# Altium schematic sheet Sheet1.SchDoc
size A3; SheetNumber: 1; SheetTotal: 1; ENG_APP_DATE: --/--/--; DSN_APP_DATE: --/--/--; CHK_APP_DATE: --/--/--
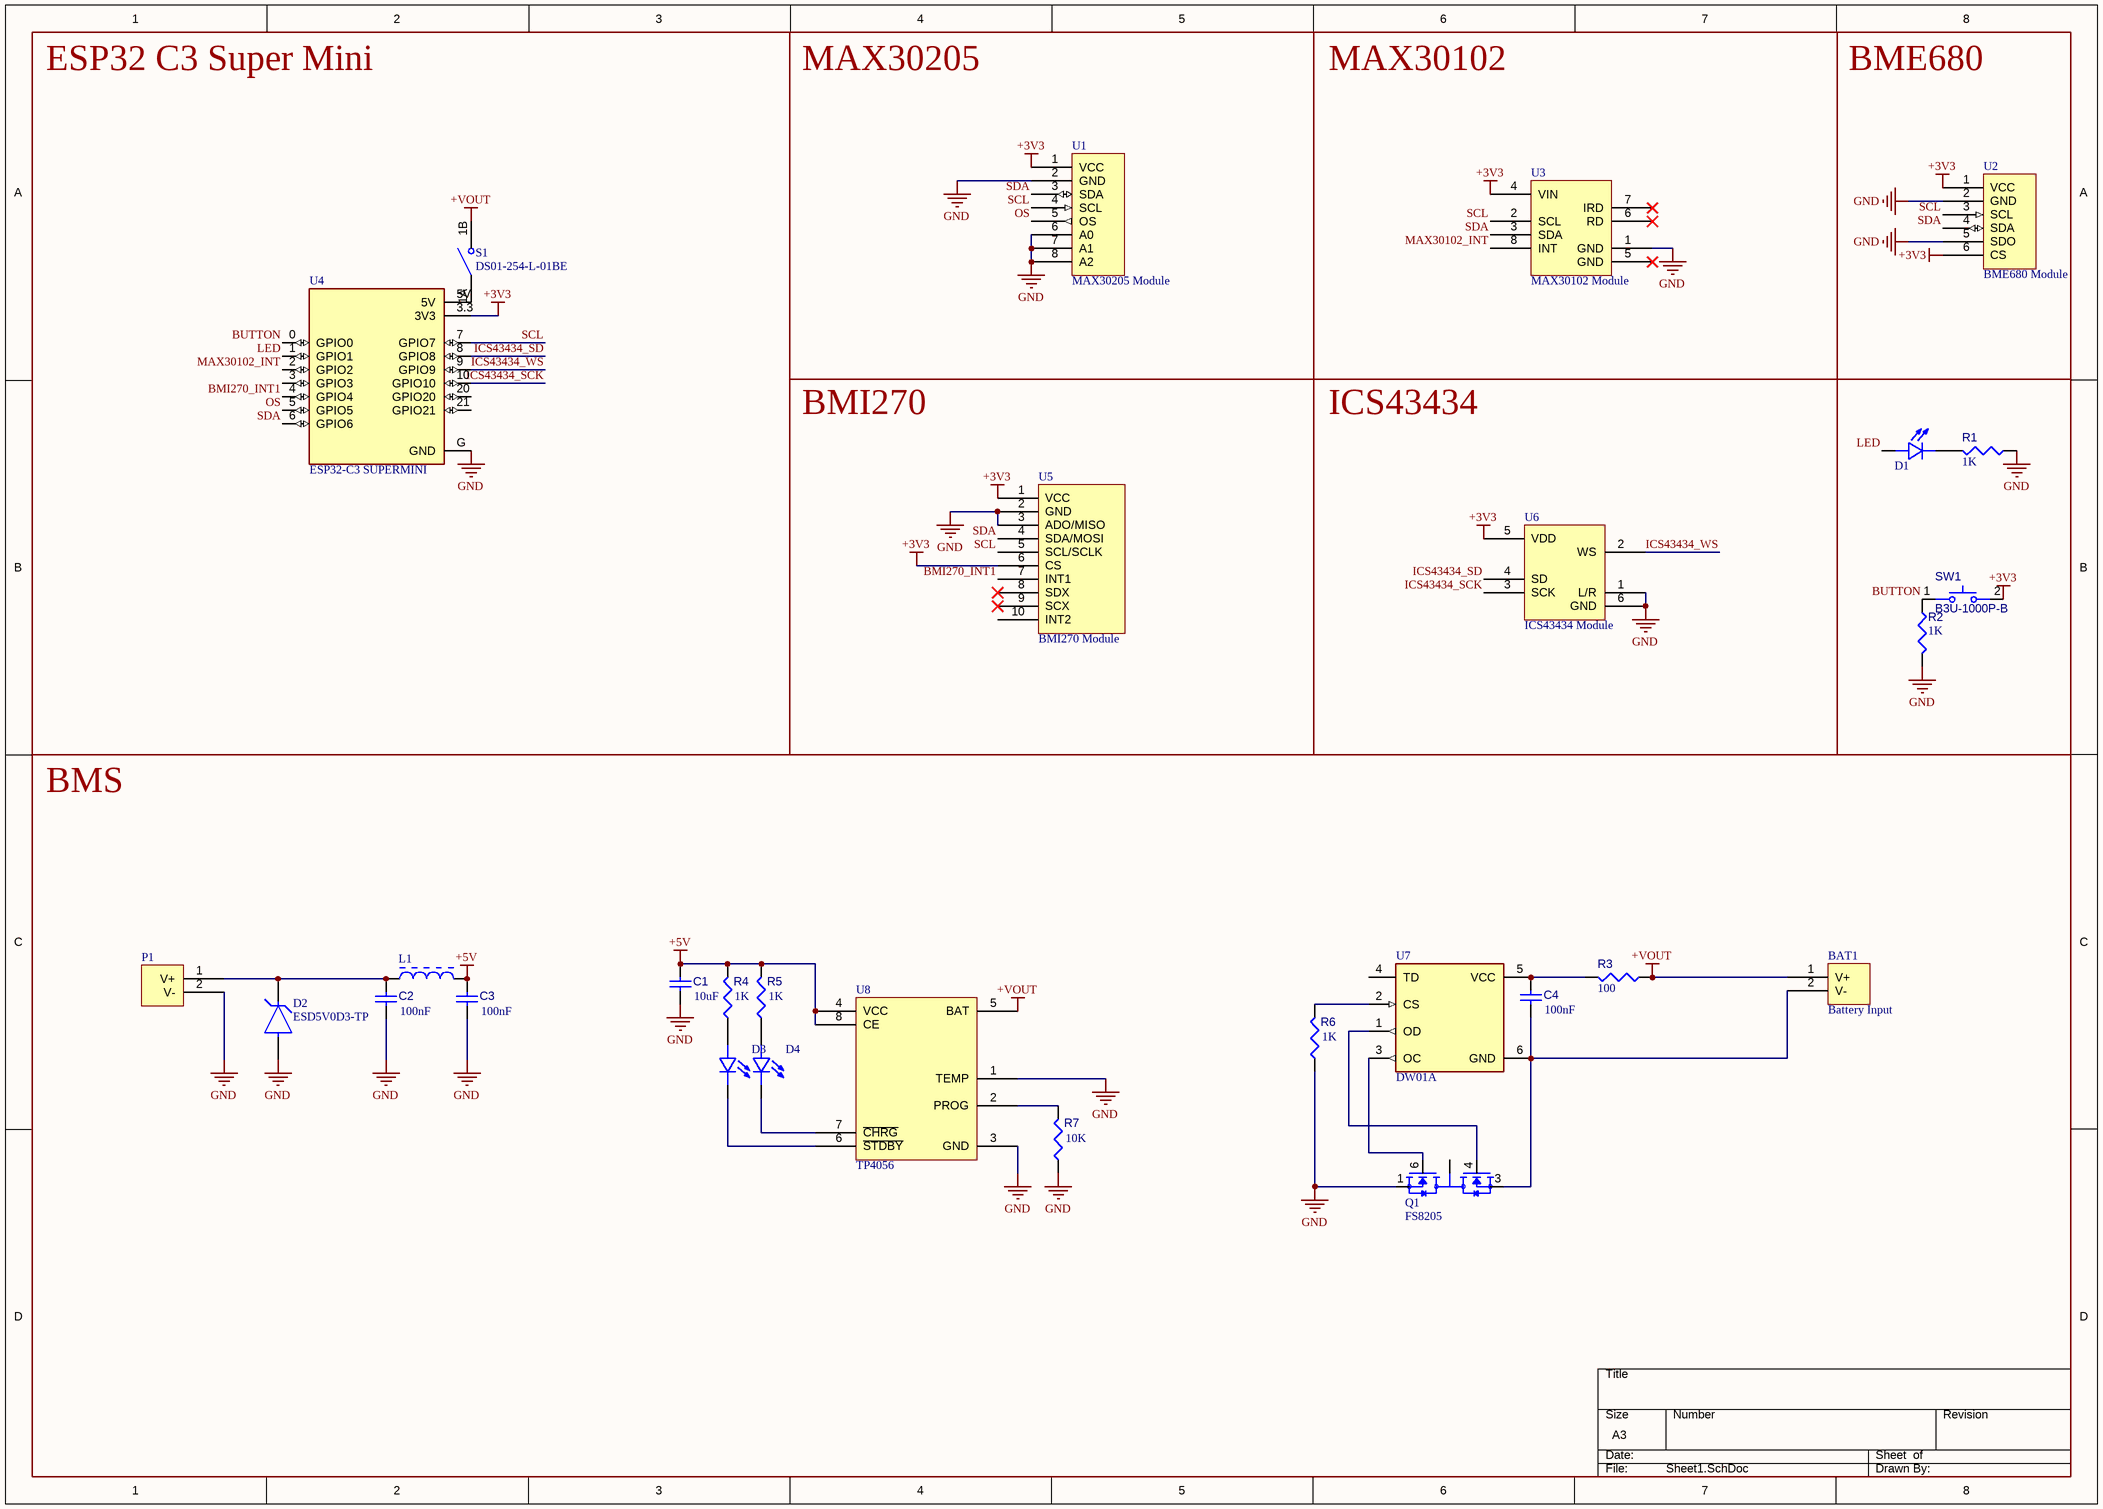
[diagram p0: Sheet1.SchDoc]

## Parts
BAT1  Battery Input  [Battery Input-Footprint-1]
C1  value 10uF  [Capacitor 0603-Footprint-1]  (hidden comment: Capacitor 0603)
C2  value 100nF  [Capacitor 0603-Footprint-1]  (hidden comment: Capacitor 0603)
C3  value 100nF  [Capacitor 0603-Footprint-1]  (hidden comment: Capacitor 0603)
C4  value 100nF  [Capacitor 0603-Footprint-1]  (hidden comment: Capacitor 0603)
D1  LED 0805  [LEDC2012X120N]  (value not drawn)
D2  ESD5V0D3-TP  [FP-SOD-323-IPC_B]
D3  LED 0805  [LEDC2012X120N]  (value not drawn)
D4  LED 0805  [LEDC2012X120N]  (value not drawn)
L1  Ferrite Bead  [INDC2013X105X50ML20T20]  (value not drawn)
P1  Magnetic Connector 2-Pin 2.54mm  [Magnetic Connector 2-Pin 2.54mm-Footprint-1]  (value not drawn)
Q1  FS8205  [SOT95P280X145-6N]
R1  value 1K  [RESC1608X55X25NL10T15]  (hidden comment: Resistor 0603)
R2  value 1K  [RESC1608X55X25NL10T15]  (hidden comment: Resistor 0603)
R3  value 100  [RESC1608X55X25NL10T15]  (hidden comment: Resistor 0603)
R4  value 1K  [RESC1608X55X25NL10T15]  (hidden comment: Resistor 0603)
R5  value 1K  [RESC1608X55X25NL10T15]  (hidden comment: Resistor 0603)
R6  value 1K  [RESC1608X55X25NL10T15]  (hidden comment: Resistor 0603)
R7  value 10K  [RESC1608X55X25NL10T15]  (hidden comment: Resistor 0603)
S1  DS01-254-L-01BE  [SW_DS01-254-L-01BE]
SW1  B3U-1000P-B  [OMRON-B3U-1000P-2-B_V]
U1  MAX30205 Module  [MAX30205 Module-Footprint-1]
U2  BME680 Module  [BME680 Module-Footprint-1]
U3  MAX30102 Module  [MAX30102 Module-Footprint-1]
U4  ESP32-C3 SUPERMINI  [MODULE_ESP32-C3_SUPERMINI_TH]
U5  BMI270 Module  [BMI270 Module-Footprint-1]
U6  ICS43434 Module  [ICS43434 Module-Footprint-1]
U7  DW01A  [SOT95P280X145-6N]
U8  TP4056  [SOP127P600X200-8N]

## Blocks framed on the sheet
ESP32 C3 Super Mini: S1 U4
MAX30205: U1
MAX30102: U3
BME680: U2
BMI270: U5
ICS43434: U6
BMS: BAT1 C1-C4 D2-D4 L1 P1 Q1 R3-R7 U7 U8

## Nets
+3V3: SW1.2 U1.1(VCC) U2.1(VCC) U2.6(CS) U3.4(VIN) U4.3.3(3V3) U5.1(VCC) U5.6(CS) U6.5(VDD)
+5V: C1.2 C3.2 L1.2 R4.2 R5.2 U8.4(VCC) U8.8(CE)
+VOUT: BAT1.1(V+) R3.1 S1.1B(NO1) U8.5(BAT)
GND: C1.1 C2.1 C3.1 D2.2(A) P1.2(V-) Q1.1(S1) R1.1 R2.2 R6.1 R7.1 U1.2(GND) U1.6(A0) U1.7(A1) U1.8(A2) U2.2(GND) U2.5(SDO) U3.1(GND) U4.G(GND) U5.2(GND) U5.3(ADO/MISO) U6.1(L/R) U6.6(GND) U8.1(TEMP) U8.3(GND)
BMI270_INT1: U4.4(GPIO4) U5.7(INT1)
BUTTON: R2.1 SW1.1 U4.0(GPIO0)
ICS43434_SCK: U4.10(GPIO10) U6.3(SCK)
ICS43434_SD: U4.8(GPIO8) U6.4(SD)
ICS43434_WS: U4.9(GPIO9) U6.2(WS)
LED: D1.A U4.1(GPIO1)
MAX30102_INT: U3.8(INT) U4.2(GPIO2)
OS: U1.5(OS) U4.5(GPIO5)
SCL: U1.4(SCL) U2.3(SCL) U3.2(SCL) U4.7(GPIO7) U5.5(SCL/SCLK)
SDA: U1.3(SDA) U2.4(SDA) U3.3(SDA) U4.6(GPIO6) U5.4(SDA/MOSI)
NetBAT1_2: BAT1.2(V-) C4.1 Q1.3(S2) U7.6(GND)
NetC2_2: C2.2 D2.1(C) L1.1 P1.1(V+)
NetC4_2: C4.2 R3.2 U7.5(VCC)
NetD1_C: D1.C R1.2
NetD3_A: D3.A R4.1
NetD3_C: D3.C U8.6(~{STDBY})
NetD4_A: D4.A R5.1
NetD4_C: D4.C U8.7(~{CHRG})
NetQ1_2: Q1.2(D12) Q1.5(D12)
NetQ1_4: Q1.4(G2) U7.1(OD)
NetQ1_6: Q1.6(G1) U7.3(OC)
NetR6_2: R6.2 U7.2(CS)
NetR7_2: R7.2 U8.2(PROG)
NetS1_1A: S1.1A(COM1) U4.5V

Not connected (* = marked no-connect by the designer): U3 5(GND)* 6(RD)* 7(IRD)*; U4 3(GPIO3) 20(GPIO20) 21(GPIO21); U5 8(SDX)* 9(SCX)* 10(INT2); U7 4(TD)

## Notes on the sheet
- DWG. NO.
- REV.
- SHT.
- THIS DOCUMENT AND THE DATA DISCLOSED HEREIN OR HEREWITH IS THE PROPERTY OF ALTIUM LIMITED AND MAY BE FREELY DISTRIBUTED IN WHOLE. NO RIGHTS ARE RESERVED OR EXPRESS OR IMPLIED WARANTEE GIVEN.
- REVISION
- DESCRIPTION
- DATE
- APPROVED
- ENG:
- APPROVALS
- PROJECT
- DSN:
- CHK:
- REFERENCE DOCUMENTS
- PROJECT REVISION:
- TITLE
- DOCUMENT REVISION:
- DESIGN ITEM:
- BOM:
- FAB DWG:
- PCB DWG:
- ASSY DWG:
- SCALE:
- SIZE
- B
- CAGE CODE
- FILE NAME
- DWG NO.
- SHEET
- OF
- REV

## Library data of the parts
BAT1 = CMP-002-00072-1: Pins: 2
C1-C4 = CMP-001-00084-1: Pins: 2; Mounting Technology: SMD; Case/Package: 0603
D1 D3 D4 = CMP-004-00043-1: LED;Red;11mcd;0.061In.Dia.;SMD;100mA;2V Vf;635nm;140deg;SMD;White Diffused;5V Vr; MF: Lumex Opto/Components; Check_prices: https://www.snapeda.com/parts/SML-LXT0805IW-TR/Lumex+Opto%252FComponents+Inc./view-part/?ref=eda; SnapEDA_Link: https://www.snapeda.com/parts/SML-LXT0805IW-TR/Lumex+Opto%252FComponents+Inc./view-part/?ref=snap; MP: SML-LXT0805IW-TR; Source: SML-LXT0805IW-TR.SchLib; Value: *; Case/Package: 0805 Lumex; Component Type: Standard; Pins: 2; Design Item ID: SML-LXT0805IW-TR
D2 = CMP-56244-000003-1: TVS DIODE 5V 15.5V SOD323; Peak Pulse Power: 350W; Max Power Dissipation: 200mW; Power Line Protection: No; Breakdown Voltage: 7.3V; Min Breakdown Voltage: 6.2V; Number of Channels: 1; Capacitance: 350pF; Peak Pulse Current: 15A; Element Configuration: Single; Leakage Current: 1uA; Termination: SMD/SMT; Mount: Surface Mount; Working Voltage: 5V; Min Operating Temperature: -55°C; Package Quantity: 1; Reverse Standoff Voltage: 5V; Number of Pins: 2; Length: 1.8mm; Clamping Voltage: 15.5V; Depth: 1.35mm; Max Operating Temperature: 150°C; Radiation Hardening: No; Max Breakdown Voltage: 7.3V; Number of Unidirectional Channels: 1; Composition: Zener; Packaging: Tape and Reel
L1 = CMP-006-00000-3: IND, Chip Ferrite Bead, 330 Ohm, +/- 25%, 1.5 A, -55 to 125 degC, 0805 (2012 Metric), Tape and Reel; Manufacturer: Murata; Current Rating: 1.5A; Impedance: 330Ohm; Resistance: 90mohm; Max Operating Temperature: 125°C; Core Material: Ferrite; Case/Package: 0805; Mounting Technology: SM; Datasheet URL: http://psearch.en.murata.com/inductor/product/LQG15HS15NJ02_.pdf; Packaging: TapeandReel; Min Operating Temperature: -55°C; RoHS Compliant: True; Max Current Rating: 1.5A; Datasheet Version: Nov-11; Package Quantity: 4000; Package Reference: 0805; Package Description: 2-Pin Surface Mount Device, Body 2 x1.25 mm; Tolerance: 25%
P1 = CMP-002-00075-1: Pins: 2
Q1 = CMP-061-000000-2: 20V 9A 1.5W Surface Mount SOT-23-6; MF: Fortune Semiconductor; Component Type: Standard; Design Item ID: FS8205; SnapEDA_Link: https://www.snapeda.com/parts/FS8205/Fortune+Semiconductor/view-part/?ref=snap; Source: FS8205.SchLib; Value: *; Pin Count: 6; Package: Package; MP: FS8205
R1-R7 = CMP-009-00179-1: Pins: 2; Mounting Technology: SMT
S1 = CMP-011-00014-2: 1 Position, Through Hole, 2.54 mm Pitch, Raised Slide Actuator, Flat Bottom, Long Pin, DIP Switch; MF: Same Sky; Source: DS01-254-L-01BE.SchLib; Case/Package: None; Design Item ID: DS01-254-L-01BE; SnapEDA_Link: https://www.snapeda.com/parts/DS01-254-L-01BE/Same+Sky/view-part/?ref=snap; MP: DS01-254-L-01BE; Pins: 2; Component Type: Standard; Value: *; Check_prices: https://www.snapeda.com/parts/DS01-254-L-01BE/Same+Sky/view-part/?ref=eda
SW1 = CMP-011-00011-3: Ultra-small Surface-mounting Tactile Switches with High Contact Reliability, SPST-NO, -25 to 70 degC, 2-Pin SMD, RoHS, Tape and Reel; Voltage Rating: 12V; Current Rating: 50mA; Pins: 2; RoHS Compliant: Details
U1 = CMP-00030-00001-1: Pins: 8
U2 = CMP-00000-2
U3 = CMP-031-00023-1: Pins: 8
U4 = CMP-067-000000-2: MF: Espressif Systems; MP: ESP32-C3 SuperMini_TH; Design Item ID: ESP32-C3_SUPERMINI_TH; Source: ESP32-C3_SUPERMINI_TH.SchLib; Component Type: Standard; Package: Package; SnapEDA_Link: https://www.snapeda.com/parts/ESP32-C3%20SuperMini_TH/Espressif+Systems/view-part/?ref=snap; Value: *; Pin Count: 16; Check_prices: https://www.snapeda.com/parts/ESP32-C3%20SuperMini_TH/Espressif+Systems/view-part/?ref=eda
U5 = CMP-00030-00002-1: Pins: 10
U6 = CMP-00027-00002-1: Pins: 6
U7 = CMP-031-00022-3: One Cell Lithium-ion/Polymer Battery Protection IC; MF: Fortune Semiconductor; MP: DW01A; Check_prices: https://www.snapeda.com/parts/DW01A/Fortune+Semiconductor/view-part/?ref=eda; Design Item ID: DW01A; Pins: 6; Case/Package: SOT-23-6 Fortune Semiconductor; Component Type: Standard; SnapEDA_Link: https://www.snapeda.com/parts/DW01A/Fortune+Semiconductor/view-part/?ref=snap; Source: DW01A.SchLib; Value: *
U8 = CMP-019-00049-1: IC Socket, 16 Contact(s), 2.54mm Term Pitch, 1.014inch Row Spacing, Surface Mount; Case/Package: ESOP8; Pins: 8